# Altium schematic sheet [5] USB-C Connector.SchDoc: Power IN - USB-C
size A3; Author: Caner ALP; CompanyName: ALP Electronics; DrawnBy: Caner Alp; Engineer: Caner Alp; Organization: ALP Electronics; Address1: Axel Oxenstiernas; Address2: Västerås; Address3: 72478; Address4: Sweden; DocumentNumber: 5; SheetNumber: 5; SheetTotal: 7
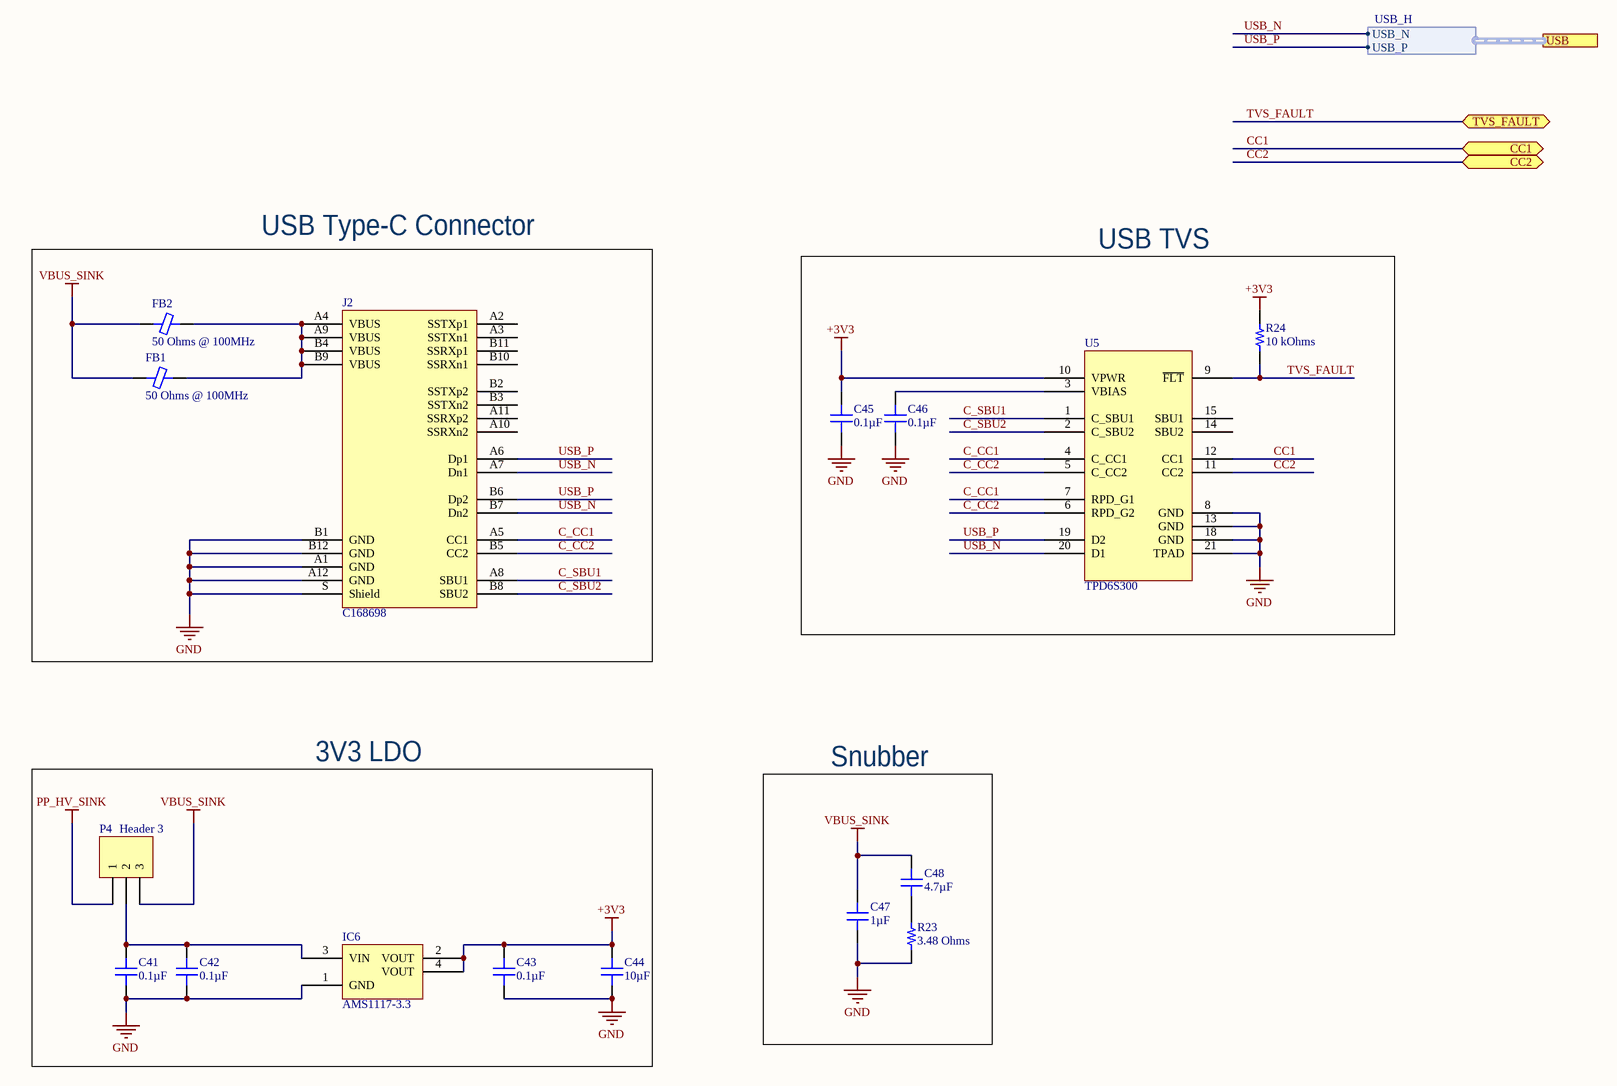
[diagram p0: [5] USB-C Connector.SchDoc]

## Parts
C41  0.1µF  [CAP 0805_2012]
C42  0.1µF  [CAP 0805_2012]
C43  0.1µF  [CAP 0805_2012]
C44  10µF  [CAP 1210_3225 - 2.8MM]
C45  0.1µF  [CAP 0603_1608]
C46  0.1µF  [CAP 0603_1608]
C47  1µF  [CAP 0805_2012]
C48  4.7µF  [CAP 0805_2012]
FB1  50 Ohms @ 100MHz  [FER 1206_3216]
FB2  50 Ohms @ 100MHz  [FER 1206_3216]
IC6  AMS1117-3.3  [ON SEMI SOT-223 ST(318H)]
J2  C168698  [USB4055]
P4  Header 3  [HEADER 2.54MM - duplicate1]
R23  3.48 Ohms  [RES 0805_2012]
R24  10 kOhms  [RES 0603_1608]
U5  TPD6S300  [WQFN - 20]

## Blocks framed on the sheet
USB Type-C Connector: FB1 FB2 J2
USB TVS: C45 C46 R24 U5
3V3 LDO: C41-C44 IC6 P4
Snubber: C47 C48 R23

## Ports
CC1 (bidir), CC2 (bidir), TVS_FAULT (bidir), USB (harness USB_H)

## Harnesses
USB_H: USB_N, USB_P

## Nets
+3V3: C43.2 C44.2 C45.2 IC6.2(VOUT) IC6.4(VOUT) R24.1 U5.10(VPWR)
GND: C41.1 C42.1 C43.1 C44.1 C45.1 C46.1 C47.1 IC6.1(GND) J2.A1(GND) J2.A12(GND) J2.B1(GND) J2.B12(GND) J2.S(Shield) R23.1 U5.8(GND) U5.13(GND) U5.18(GND) U5.21(TPAD)
PP_HV_SINK: P4.1
VBUS_SINK: C47.2 C48.1 FB1.1 FB2.1 P4.3
C_CC1: J2.A5(CC1) U5.4(C_CC1) U5.7(RPD_G1)
C_CC2: J2.B5(CC2) U5.5(C_CC2) U5.6(RPD_G2)
C_SBU1: J2.A8(SBU1) U5.1(C_SBU1)
C_SBU2: J2.B8(SBU2) U5.2(C_SBU2)
CC1: U5.12(CC1) ; port CC1
CC2: U5.11(CC2) ; port CC2
TVS_FAULT: R24.2 U5.9(~{FLT}) ; port TVS_FAULT
USB_N: J2.A7(Dn1) J2.B7(Dn2) U5.20(D1) ; port USB.USB_N
USB_P: J2.A6(Dp1) J2.B6(Dp2) U5.19(D2) ; port USB.USB_P
NetC41_2: C41.2 C42.2 IC6.3(VIN) P4.2
NetC46_2: C46.2 U5.3(VBIAS)
NetC48_2: C48.2 R23.2
NetFB1_2: FB1.2 FB2.2 J2.A4(VBUS) J2.A9(VBUS) J2.B4(VBUS) J2.B9(VBUS)

Not connected (* = marked no-connect by the designer): J2 A2(SSTXp1) A3(SSTXn1) A10(SSRXn2) A11(SSRXp2) B2(SSTXp2) B3(SSTXn2) B10(SSRXn1) B11(SSRXp1); U5 14(SBU2) 15(SBU1) 16(NC) 17(NC)

## Notes on the sheet
- Title
- Size:
- Project
- A3
- Revision:
- Date:
- Sheet
- of

## Library data of the parts
C41-C43 = 160R15W104KV4T: CAP CER 0.1UF 16V X7R 0805; Manufacturer: Johanson Dielectrics Inc.; Tolerance: ±10%; Part Number: 160R15W104KV4T; Value: 0.1µF; Applications: General Purpose; Capacitance: 0.1µF; ComponentLink1Description: Datasheet; ComponentLink1URL: https://www.johansondielectrics.com/downloads/catalog/johanson-dielectrics-product-catalog.pdf; ComponentLink2Description: DigiKey Link; ComponentLink2URL: http://digikey.com/product-detail/en/johanson-dielectrics-inc/160R15W104KV4T/709-1183-1-ND/1859515; Device Package: 0805 (2012 Metric); LastUpdated: 21/01/2020 00:02:56; Lifecycle Status: Active; Minimum Order: 1; Mounting Type: Surface Mount, MLCC; Operating Temperature: -55°C ~ 125°C; Package / Case: 0805 (2012 Metric); Packaging: TapeAndReel; PartId: 9125; Part Status: Active; Price: 0.03; Series: -; Size / Dimension: 0.080" L x 0.050" W (2.03mm x 1.27mm); Supplier 1: DigiKey; Supplier Part Number 1: 709-1183-1-ND; Temperature Coefficient: X7R; Thickness (Max): 0.050" (1.27mm); Voltage - Rated: 16V
C44 = C1210C106K3RACAUTO: CAP CER 10UF 25V X7R 1210; Manufacturer: KEMET; Tolerance: ±10%; Part Number: C1210C106K3RACAUTO; Value: 10µF; Applications: Automotive, Bypass, Decoupling; Capacitance: 10µF; ComponentLink1Description: Datasheet; ComponentLink1URL: //media.digikey.com/pdf/Data%20Sheets/Kemet%20PDFs/C1210C106K3RACAUTO.pdf; ComponentLink2Description: DigiKey Link; ComponentLink2URL: http://digikey.com/product-detail/en/kemet/C1210C106K3RACAUTO/399-7046-1-ND/3314553; Device Package: 1210 (3225 Metric); LastUpdated: 21/01/2020 00:30:50; Lifecycle Status: Active; Minimum Order: 1; Mounting Type: Surface Mount, MLCC; Operating Temperature: -55°C ~ 125°C; Package / Case: 1210 (3225 Metric); Packaging: TapeAndReel; PartId: 23626; Part Status: Active; Price: 0.22; Ratings: AEC-Q200; Series: SMD Auto X7R; Size / Dimension: 0.126" L x 0.098" W (3.20mm x 2.50mm); Supplier 1: DigiKey; Supplier Part Number 1: 399-7046-1-ND; Temperature Coefficient: X7R; Thickness (Max): 0.106" (2.70mm); Voltage - Rated: 25V
C45 C46 = 0603B104J160CT: CAP CER 0.1UF 16V X7R 0603; Manufacturer: Walsin Technology Corporation; Tolerance: ±5%; Part Number: 0603B104J160CT; Value: 0.1µF; Applications: General Purpose; Capacitance: 0.1µF; ComponentLink1Description: Datasheet; ComponentLink1URL: http://www.passivecomponent.com/wp-content/uploads/2018/10/MLCC.pdf; ComponentLink2Description: DigiKey Link; ComponentLink2URL: http://digikey.com/product-detail/en/walsin-technology-corporation/0603B104J160CT/1292-1389-1-ND/9355393; Device Package: 0603 (1608 Metric); LastUpdated: 21/01/2020 00:01:52; Lifecycle Status: Active; Minimum Order: 1; Mounting Type: Surface Mount, MLCC; Operating Temperature: -55°C ~ 125°C; Package / Case: 0603 (1608 Metric); Packaging: TapeAndReel; PartId: 13150; Part Status: Active; Price: 0.02; Series: -; Size / Dimension: 0.063" L x 0.031" W (1.60mm x 0.80mm); Supplier 1: DigiKey; Supplier Part Number 1: 1292-1389-1-ND; Temperature Coefficient: X7R; Thickness (Max): 0.034" (0.87mm); Voltage - Rated: 16V
C47 = 08055C105K4Z2A: CAP CER 1UF 50V X7R 0805; Manufacturer: AVX Corporation; Tolerance: ±10%; Part Number: 08055C105K4Z2A; Value: 1µF; Applications: Automotive, Boardflex Sensitive; Capacitance: 1µF; ComponentLink1Description: Datasheet; ComponentLink1URL: http://datasheets.avx.com/FlexitermMLCC.pdf; ComponentLink2Description: DigiKey Link; ComponentLink2URL: http://digikey.com/product-detail/en/avx-corporation/08055C105K4Z2A/478-9557-1-ND/5322895; Device Package: 0805 (2012 Metric); Features: Soft Termination; LastUpdated: 21/01/2020 00:03:05; Lifecycle Status: Active; Minimum Order: 1; Mounting Type: Surface Mount, MLCC; Operating Temperature: -55°C ~ 125°C; Package / Case: 0805 (2012 Metric); Packaging: TapeAndReel; PartId: 2983; Part Status: Active; Price: 0.09; Ratings: AEC-Q200; Series: FLEXITERM®; Size / Dimension: 0.079" L x 0.049" W (2.00mm x 1.25mm); Supplier 1: DigiKey; Supplier Part Number 1: 478-9557-1-ND; Temperature Coefficient: X7R; Thickness (Max): 0.055" (1.40mm); Voltage - Rated: 50V
C48 = C2012JB1H475K125AB: CAP CER 4.7UF 50V JB 0805; Manufacturer: TDK Corporation; Tolerance: ±10%; Part Number: C2012JB1H475K125AB; Value: 4.7µF; Applications: General Purpose; Capacitance: 4.7µF; ComponentLink1Description: Datasheet; ComponentLink1URL: https://product.tdk.com/info/en/catalog/datasheets/mlcc_commercial_general_en.pdf?ref_disty=digikey; ComponentLink2Description: DigiKey Link; ComponentLink2URL: http://digikey.com/product-detail/en/tdk-corporation/C2012JB1H475K125AB/445-11510-1-ND/3953176; Device Package: 0805 (2012 Metric); Features: Low ESL; LastUpdated: 21/01/2020 00:02:45; Lifecycle Status: Active; Minimum Order: 1; Mounting Type: Surface Mount, MLCC; Operating Temperature: -25°C ~ 85°C; Package / Case: 0805 (2012 Metric); Packaging: TapeAndReel; PartId: 15333; Part Status: Active; Price: 0.18; Series: C; Size / Dimension: 0.079" L x 0.049" W (2.00mm x 1.25mm); Supplier 1: DigiKey; Supplier Part Number 1: 445-11510-1-ND; Temperature Coefficient: JB; Thickness (Max): 0.057" (1.45mm); Voltage - Rated: 50V
FB1 FB2 = BLM31SN500SZ1L: FERRITE BEAD 50 OHM 1206 1LN; Manufacturer: Murata Electronics; Current Rating (Max): 12A; DC Resistance (DCR) (Max): 1.6mOhm; Filter Type: Power Line; Number of Lines: 1; Part Number: BLM31SN500SZ1L; ComponentLink1Description: Datasheet; ComponentLink1URL: https://www.murata.com/en-us/products/productdata/8796751200286/QNFA9115.pdf; ComponentLink2Description: DigiKey Link; ComponentLink2URL: http://digikey.com/product-detail/en/murata-electronics/BLM31SN500SZ1L/490-13270-1-ND/5881270; Device Package: 1206 (3216 Metric); Height (Max): 0.051" (1.30mm); Impedance @ Frequency: 50 Ohms @ 100MHz; LastUpdated: 21/01/2020 02:29:52; Lifecycle Status: Active; Minimum Order: 1; Mounting Type: Surface Mount; Operating Temperature: -55°C ~ 125°C; Package / Case: 1206 (3216 Metric); Packaging: TapeAndReel; PartId: 1661; Part Status: Active; Price: 0.12; Ratings: AEC-Q200; Series: EMIFIL®, BLM31; Size / Dimension: 0.126" L x 0.063" W (3.20mm x 1.60mm); Supplier 1: DigiKey; Supplier Part Number 1: 490-13270-1-ND; Value: 50 Ohms @ 100MHz
IC6 = NCP1117ST33T3G: IC REG LDO 3.3V 1A SOT223; Manufacturer: ON Semiconductor; Topology: Positive Fixed; Voltage Dropout: 1.07V @ 800mA; Voltage - Input: Up to 20V; Part Number: NCP1117ST33T3G; PartId: 7932; Supplier 1: Digi-Key; Supplier Part Number 1: NCP1117ST33T3GOSTR-ND; ComponentLink1Description: Datasheet; ComponentLink1URL: http://www.onsemi.com/pub_link/Collateral/NCP1117-D.PDF; ComponentLink2Description: Digi-Key Listing; ComponentLink2URL: http://www.digikey.ca/product-detail/en/NCP1117ST33T3G/NCP1117ST33T3GOSTR-ND/1749063; Price: 0.2342; Device Package: TO-261-4, TO-261AA; Voltage - Output: 3.3V; Current - Limit (Min): 1A; Operating Temperature: 0C ~ 125C
J2 = C168698: USB 3.1 TYPE C MID MOUNT HYBRID; Manufacturer: Jing Extension; Number Of Positions: 24; Part Number: C168698; PartId: 9702; Supplier 1: LCSC; Supplier Part Number 1: C168698; ComponentLink1Description: Datasheet; ComponentLink1URL: https://datasheet.lcsc.com/szlcsc/1811131841_Jing-Extension-of-the-Electronic-Co-C168698_C168698.pdf,; ComponentLink2Description: Alternative; ComponentLink2URL: https://gct.co/connector/usb4055; Type: USB - C; Series: USB 3.1, Superspeed+
P4 = Header 3: Header, 3-Pin; LatestRevisionDate: 17-Jul-2002; LatestRevisionNote: Re-released for DXP Platform.; Publisher: Altium Limited
R23 = RC0805FR-073R48L: RES SMD 3.48 OHM 1% 1/8W 0805; Manufacturer: Yageo; Power (Watts): 0.125W, 1/8W; Temperature Coefficient: ±200ppm/°C; Part Number: RC0805FR-073R48L; Value: 3.48 Ohms; ComponentLink1Description: Datasheet; ComponentLink1URL: https://www.yageo.com/upload/media/product/productsearch/datasheet/rchip/PYu-RC_Group_51_RoHS_L_10.pdf; ComponentLink2Description: DigiKey Link; ComponentLink2URL: http://digikey.com/product-detail/en/yageo/RC0805FR-073R48L/311-3.48CRCT-ND/730768; Composition: Thick Film; Device Package: 0805 (2012 Metric); Features: Moisture Resistant; Height - Seated (Max): 0.024" (0.60mm); LastUpdated: 21/01/2020 01:49:21; Lifecycle Status: Active; Minimum Order: 1; Number of Terminations: 2; Operating Temperature: -55°C ~ 155°C; Package / Case: 0805 (2012 Metric); Packaging: TapeAndReel; PartId: 29394; Part Status: Active; Price: 0.01; Resistance: 3.48 Ohms; Series: RC; Size / Dimension: 0.079" L x 0.049" W (2.00mm x 1.25mm); Supplier 1: DigiKey; Supplier Part Number 1: 311-3.48CRCT-ND; Supplier Device Package: 0805; Tolerance: ±1%
R24 = CRCW060310K0JNEA: RES SMD 10K OHM 5% 1/10W 0603; Manufacturer: Vishay Dale; Power (Watts): 0.1W, 1/10W; Temperature Coefficient: ±200ppm/°C; Part Number: CRCW060310K0JNEA; Value: 10 kOhms; ComponentLink1Description: Datasheet; ComponentLink1URL: http://www.vishay.com/docs/20035/dcrcwe3.pdf; ComponentLink2Description: DigiKey Link; ComponentLink2URL: http://digikey.com/product-detail/en/vishay-dale/CRCW060310K0JNEA/541-10KGCT-ND/1179393; Composition: Thick Film; Device Package: 0603 (1608 Metric); Features: Automotive AEC-Q200; Height - Seated (Max): 0.020" (0.50mm); LastUpdated: 21/01/2020 00:24:50; Lifecycle Status: Active; Minimum Order: 1; Number of Terminations: 2; Operating Temperature: -55°C ~ 155°C; Package / Case: 0603 (1608 Metric); Packaging: CutTape; PartId: 5216; Part Status: Active; Price: 0.10; Ratings: AEC-Q200; Resistance: 10 kOhms; Series: CRCW; Size / Dimension: 0.063" L x 0.033" W (1.60mm x 0.85mm); Supplier 1: DigiKey; Supplier Part Number 1: 541-10KGCT-ND; Supplier Device Package: 0603; Tolerance: ±5%